# Altium schematic sheet sheet4.SchDoc
size A4
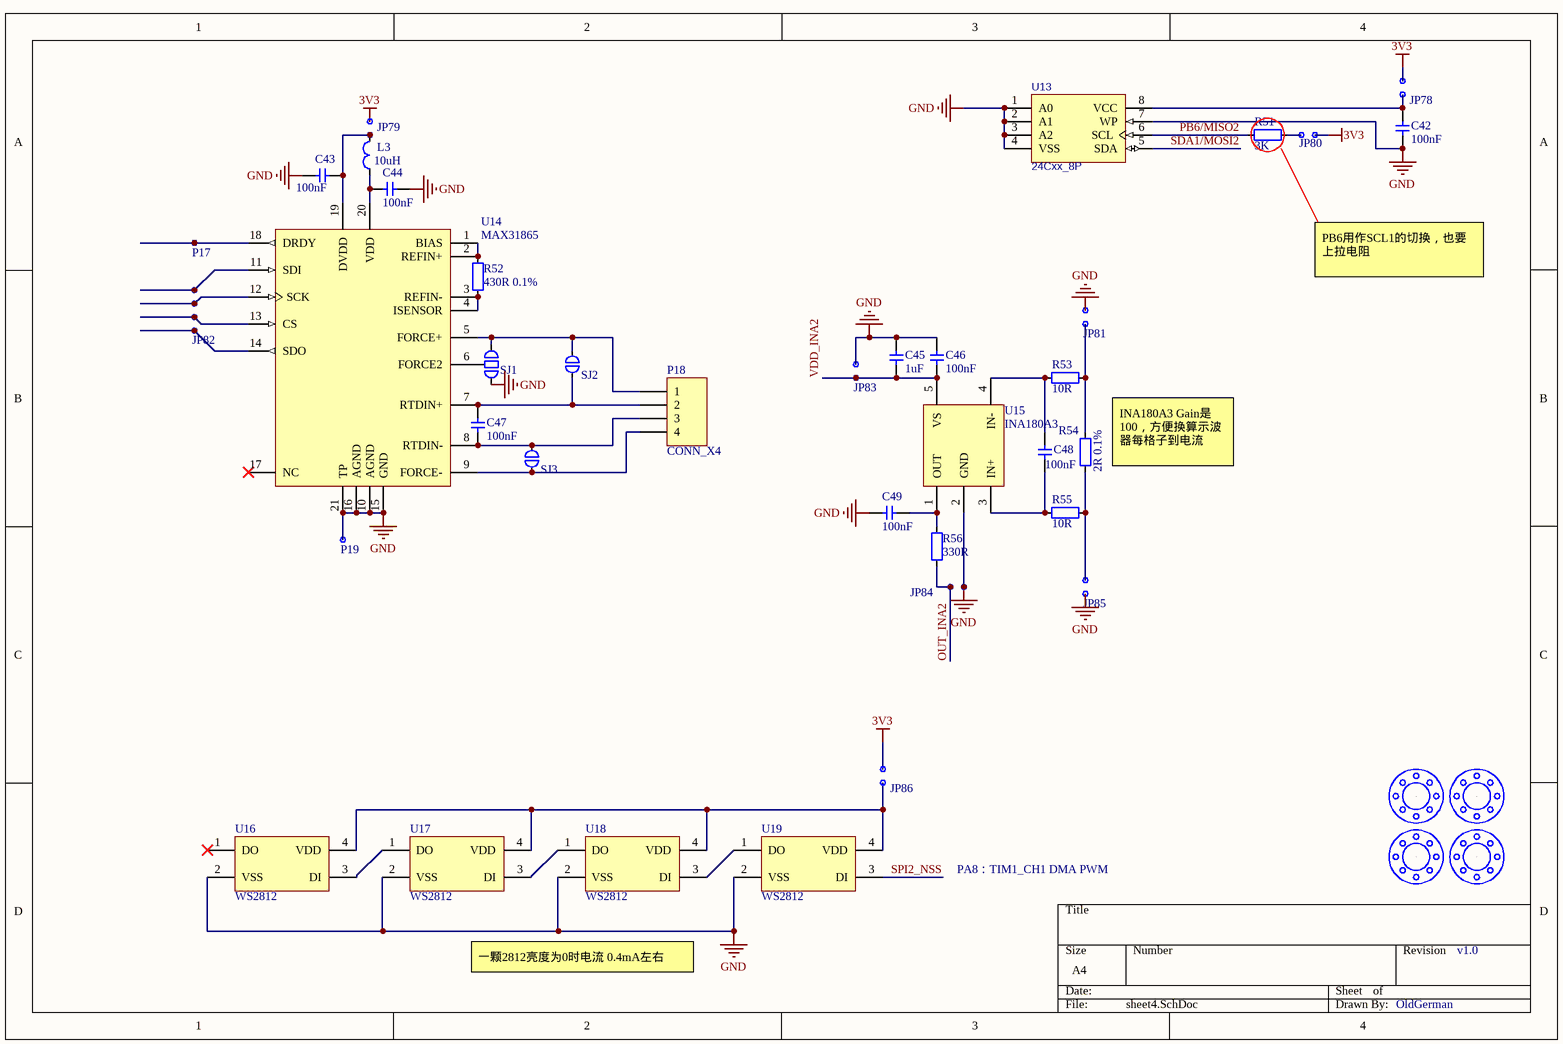
[diagram p0: sheet4.SchDoc]

## Parts
C42  100nF  [C0603]
C43  100nF  [C0603]
C44  100nF  [C0603]
C45  1uF  [C0603]
C46  100nF  [C0603]
C47  100nF  [C0603]
C48  100nF  [C0603]
C49  100nF  [C0603]
JP78  CONN_X2_DOT  [2.54mm_Male_x2]  (value not drawn)
JP79  CONN_X2_DOT  [2.54mm_Male_x2]  (value not drawn)
JP80  CONN_X2_DOT  [2.54mm_Male_x2]  (value not drawn)
JP81  CONN_X2_DOT  [2.54mm_Male_x2]  (value not drawn)
JP82  CONN_X4_DOT  [2.54mm_Male_x4]  (value not drawn)
JP83  CONN_X2_DOT  [2.54mm_Male_x2]  (value not drawn)
JP84  CONN_X2_DOT  [2.54mm_Male_x2]  (value not drawn)
JP85  CONN_X2_DOT  [2.54mm_Male_x2]  (value not drawn)
JP86  CONN_X2_DOT  [2.54mm_Male_x2]  (value not drawn)
L3  10uH  [FER0603]
P17  CONN_X1_DOT  [2.54mm_Male_x1]  (value not drawn)
P18  CONN_X4  [2.54mm_Male_x4]
P19  CONN_X1_DOT  [2.54mm_Male_x1]  (value not drawn)
R51  3K  [R0603]
R52  430R 0.1%  [R0603]
R53  10R  [R0603]
R54  2R 0.1%  [R0805]
R55  10R  [R0603]
R56  330R  [R0603]
SJ1  SJ_3P  [SJ_3P]  (value not drawn)
SJ2  SJ_2P  [SJ_2P]  (value not drawn)
SJ3  SJ_2P  [SJ_2P]  (value not drawn)
SUN_HOLE1  SUN_HOLE  [SUN_HOLE_M3]  (value not drawn)
SUN_HOLE2  SUN_HOLE  [SUN_HOLE_M3]  (value not drawn)
SUN_HOLE3  SUN_HOLE  [SUN_HOLE_M3]  (value not drawn)
SUN_HOLE4  SUN_HOLE  [SUN_HOLE_M3]  (value not drawn)
U13  24Cxx_8P  [ANALOG DEV SOIC-8 R8]
U14  MAX31865  [VQFN-20 5x5MM 0.65]
U15  INA180A3  [TI SOT-23-5 DBV]
U16  WS2812  [WS2812_2020]
U17  WS2812  [WS2812_2020]
U18  WS2812  [WS2812_2020]
U19  WS2812  [WS2812_2020]

## Nets
3V3: JP78.1 JP79.1 JP80.2 JP86.1
GND: C42.2 C43.2 C44.2 C45.2 C46.2 C49.2 JP81.1 JP83.1 JP84.2 JP85.2 P19.1 SJ1.3 U13.1(A0) U13.2(A1) U13.3(A2) U13.4(VSS) U13.7(WP) U14.10(AGND) U14.15(GND) U14.16(AGND) U14.21(TP) U15.2(GND) U16.2(VSS) U17.2(VSS) U18.2(VSS) U19.2(VSS)
OUT_INA2: JP84.1 R56.1
PB6/MISO2: R51.1 U13.6(SCL)
SDA1/MOSI2: U13.5(SDA)
SPI2_NSS: U19.3(DI)
VDD_INA2: C45.1 C46.1 JP83.2 U15.5(VS)
NetC42_1: C42.1 JP78.2 U13.8(VCC)
NetC43_1: C43.1 JP79.2 L3.2 U14.19(DVDD)
NetC44_1: C44.1 L3.1 U14.20(VDD)
NetC47_1: C47.1 P18.2 SJ2.2 U14.7(RTDIN+)
NetC47_2: C47.2 P18.3 SJ3.1 U14.8(RTDIN-)
NetC48_1: C48.1 R55.1 U15.3(IN+)
NetC48_2: C48.2 R53.1 U15.4(IN-)
NetC49_1: C49.1 R56.2 U15.1(OUT)
NetJP80_1: JP80.1 R51.2
NetJP81_2: JP81.2 R53.2 R54.1
NetJP82_1: JP82.1 U14.11(SDI)
NetJP82_2: JP82.2 U14.12(SCK)
NetJP82_3: JP82.3 U14.13(CS)
NetJP82_4: JP82.4 U14.14(SDO)
NetJP85_1: JP85.1 R54.2 R55.2
NetJP86_2: JP86.2 U16.4(VDD) U17.4(VDD) U18.4(VDD) U19.4(VDD)
NetP17_1: P17.1 U14.18(DRDY)
NetP18_1: P18.1 SJ1.1 SJ2.1 U14.5(FORCE+)
NetP18_4: P18.4 SJ3.2 U14.9(FORCE-)
NetR52_1: R52.1 U14.3(REFIN-) U14.4(ISENSOR)
NetR52_2: R52.2 U14.1(BIAS) U14.2(REFIN+)
NetSJ1_2: SJ1.2 U14.6(FORCE2)
NetU16_3: U16.3(DI) U17.1(DO)
NetU17_3: U17.3(DI) U18.1(DO)
NetU18_3: U18.3(DI) U19.1(DO)

Not connected (* = marked no-connect by the designer): SUN_HOLE1 1; SUN_HOLE2 1; SUN_HOLE3 1; SUN_HOLE4 1; U14 17(NC)*; U16 1(DO)*

## Notes on the sheet
- PB6用作SCL1的切换，也要上拉电阻
- INA180A3 Gain是100，方便换算示波器每格子到电流
- PA8：TIM1_CH1 DMA PWM
- 一颗2812亮度为0时电流 0.4mA左右
- v1.0
- OldGerman

## Library data of the parts
C42-C49 = CAP: Capacitor; Value: 0.1u
L3 = inductor_mini: 贴片叠层电感
R51-R56 = RES: Resistor; Value: 22R
SJ1 = SJ_3P: 焊接跳线二选一
SJ2 SJ3 = SJ_2P: 焊接跳线
U15 = INA180Ax: Low- and High-Side Voltage Output, Current-Sense Amplifiers